# Altium schematic sheet ControlBoard.SchDoc
size A4
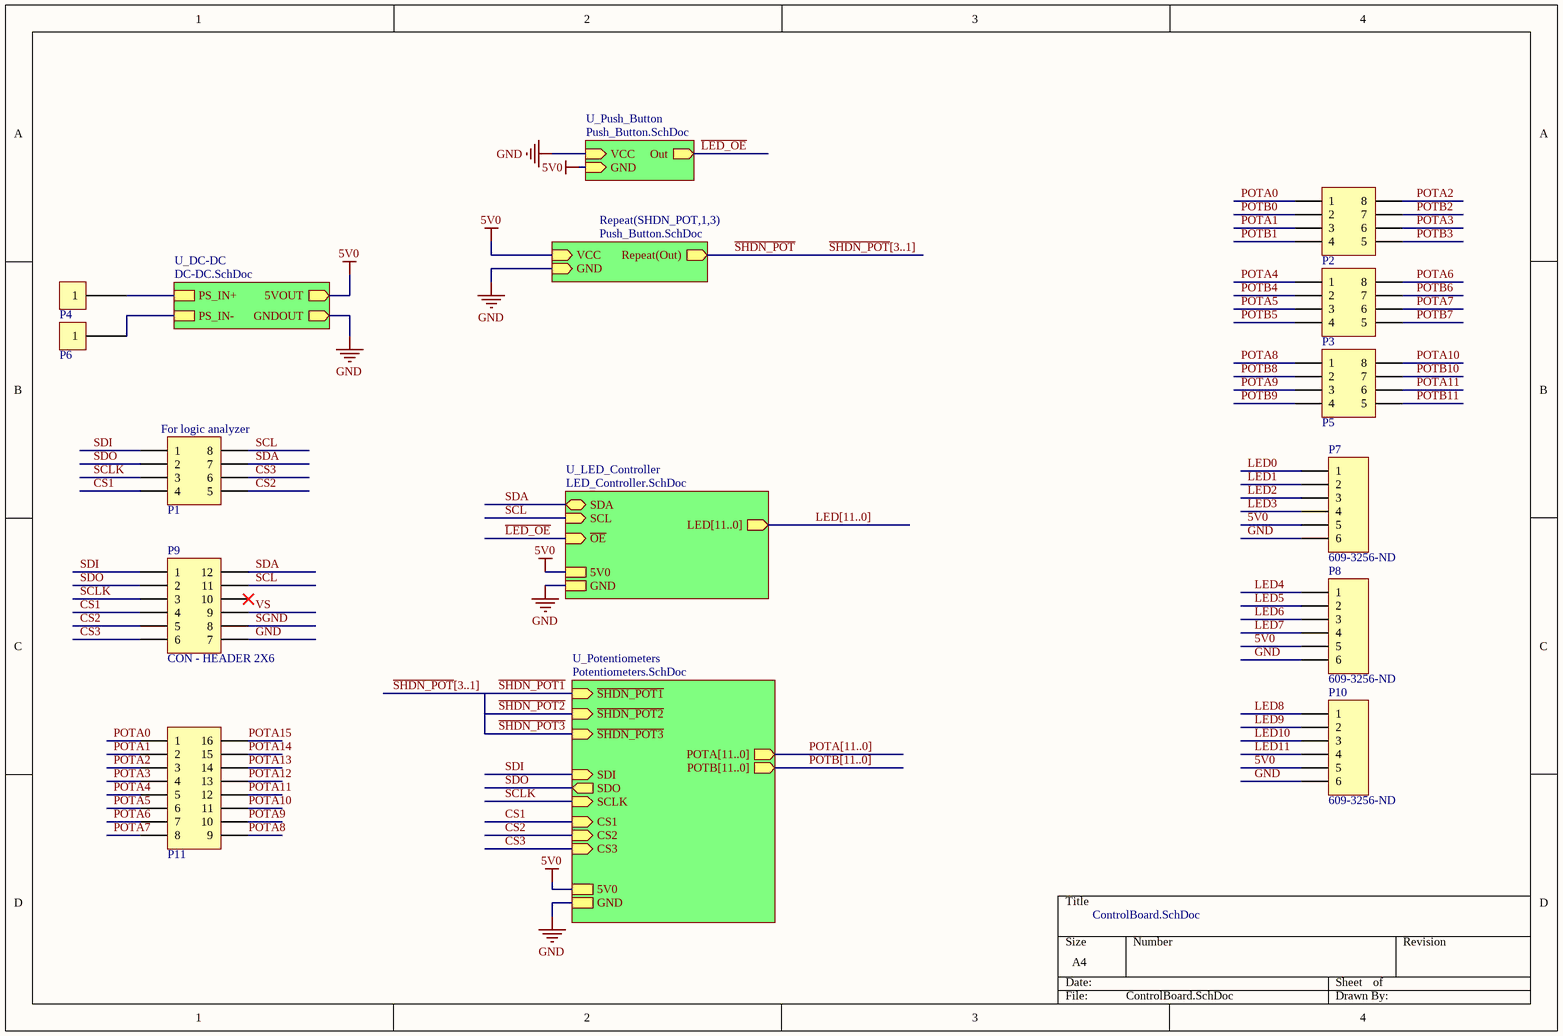
[diagram p0: ControlBoard.SchDoc]

## Parts
P1  CON - HEADER 2X4  [CON-HEADER-2X4]  (value not drawn)
P2  CON - HEADER 2X4  [CON-HEADER-2X4]  (value not drawn)
P3  CON - HEADER 2X4  [CON-HEADER-2X4]  (value not drawn)
P4  CON - BANANA  [CON-PCB BANANA RED]  (value not drawn)
P5  CON - HEADER 2X4  [CON-HEADER-2X4]  (value not drawn)
P6  CON - BANANA  [CON-PCB BANANA BLACK]  (value not drawn)
P7  Supplier Part Number 1: 609-3256-ND  [CON-HEADER-1X6]  (hidden comment: CON - HEADER 1X6)
P8  Supplier Part Number 1: 609-3256-ND  [CON-HEADER-1X6]  (hidden comment: CON - HEADER 1X6)
P9  CON - HEADER 2X6  [CON-HEADER-2X6]
P10  Supplier Part Number 1: 609-3256-ND  [CON-HEADER-1X6]  (hidden comment: CON - HEADER 1X6)
P11  CON - HEADER 2X8  [CON-HEADER-2X8]  (value not drawn)

## Sub-sheets
Repeat(SHDN_POT,1,3) = Push_Button.SchDoc: Repeat(Out) (out), GND (in), VCC (in)
U_DC-DC = DC-DC.SchDoc: 5VOUT (out), PS_IN+, PS_IN-, GNDOUT (out)
U_LED_Controller = LED_Controller.SchDoc: SDA (bidir), SCL (in), ~{OE} (in), 5V0, GND, LED[11..0] (out)
U_Potentiometers = Potentiometers.SchDoc: SDI (in), SCLK (in), CS1 (in), CS2 (in), CS3 (in), 5V0, GND, SDO (out), ~{SHDN_POT3} (in), ~{SHDN_POT2} (in), ~{SHDN_POT1} (in), POTA[11..0] (out), POTB[11..0] (out)
U_Push_Button = Push_Button.SchDoc: Out (out), VCC (in), GND (in)

## Nets
5V0: P7.5 P8.5 P10.5 ; sheet U_LED_Controller/5V0, sheet U_Potentiometers/5V0, sheet Repeat(SHDN_POT,1,3)/VCC, sheet U_Push_Button/GND, sheet U_DC-DC/5VOUT
GND: P7.6 P8.6 P9.7 P10.6 ; sheet U_LED_Controller/GND, sheet U_Potentiometers/GND, sheet Repeat(SHDN_POT,1,3)/GND, sheet U_Push_Button/VCC, sheet U_DC-DC/GNDOUT
CS1: P1.4 P9.4 ; sheet U_Potentiometers/CS1
CS2: P1.5 P9.5 ; sheet U_Potentiometers/CS2
CS3: P1.6 P9.6 ; sheet U_Potentiometers/CS3
~{LED_OE}: sheet U_LED_Controller/~{OE}, sheet U_Push_Button/Out
LED0: P7.1
LED1: P7.2
LED2: P7.3
LED3: P7.4
LED4: P8.1
LED5: P8.2
LED6: P8.3
LED7: P8.4
LED8: P10.1
LED9: P10.2
LED10: P10.3
LED11: P10.4
POTA0: P2.1 P11.1
POTA1: P2.3 P11.2
POTA2: P2.8 P11.3
POTA3: P2.6 P11.4
POTA4: P3.1 P11.5
POTA5: P3.3 P11.6
POTA6: P3.8 P11.7
POTA7: P3.6 P11.8
POTA8: P5.1 P11.9
POTA9: P5.3 P11.10
POTA10: P5.8 P11.11
POTA11: P5.6 P11.12
POTA12: P11.13
POTA13: P11.14
POTA14: P11.15
POTA15: P11.16
POTB0: P2.2
POTB1: P2.4
POTB2: P2.7
POTB3: P2.5
POTB4: P3.2
POTB5: P3.4
POTB6: P3.7
POTB7: P3.5
POTB8: P5.2
POTB9: P5.4
POTB10: P5.7
POTB11: P5.5
~{SHDN_POT}: sheet Repeat(SHDN_POT,1,3)/Repeat(Out)
~{SHDN_POT1}: sheet U_Potentiometers/~{SHDN_POT1}
~{SHDN_POT2}: sheet U_Potentiometers/~{SHDN_POT2}
~{SHDN_POT3}: sheet U_Potentiometers/~{SHDN_POT3}
SCL: P1.8 P9.11 ; sheet U_LED_Controller/SCL
SCLK: P1.3 P9.3 ; sheet U_Potentiometers/SCLK
SDA: P1.7 P9.12 ; sheet U_LED_Controller/SDA
SDI: P1.1 P9.1 ; sheet U_Potentiometers/SDI
SDO: P1.2 P9.2 ; sheet U_Potentiometers/SDO
SGND: P9.8
VS: P9.9
NetP4_1: P4.1 ; sheet U_DC-DC/PS_IN+
NetP6_1: P6.1 ; sheet U_DC-DC/PS_IN-

Not connected (* = marked no-connect by the designer): P9 10*

## Buses and harness runs
bus LED[11..0] = sheet U_LED_Controller/LED[11..0]
bus POTA[11..0] = sheet U_Potentiometers/POTA[11..0]
bus POTB[11..0] = sheet U_Potentiometers/POTB[11..0]
bus ~{SHDN_POT}[3..1]

## Notes on the sheet
- (near P1) For logic analyzer

## Library data of the parts
P1-P3 P5 = CON - HEADER 2X4: 100mil header 2 row 8pins; Manufacturer: *; (FIELD A): *; (FIELD B): *; (FIELD C): *; Supplier 1: Digi-Key; Supplier Part Number 1: 952-2122-ND
P7 P8 P10 = CON - HEADER 1X6: 100mil header 1 row 6 pins; Manufacturer: *; (FIELD A): *; (FIELD B): *; (FIELD C): *; Supplier 1: Digi-Key
P9 = CON - HEADER 2X6: 100mil header 2 row 12pins; Manufacturer: *; (FIELD A): *; (FIELD B): *; (FIELD C): *; Supplier 1: Digi-Key; Supplier Part Number 1: 952-2125-ND
P11 = CON - HEADER 2X8: 100mil header 2 row 16pins; Manufacturer: *; (FIELD A): *; (FIELD B): *; (FIELD C): *; Supplier 1: Digi-Key; Supplier Part Number 1: 952-2128-ND
P4 P6 = CON - BANANA: Supplier 1: Digi-Key; Supplier 2: Digi-Key; Supplier Part Number 1: J110-ND; Supplier Part Number 2: J109-ND